# Altium schematic sheet Microcontroller.SchDoc
size A
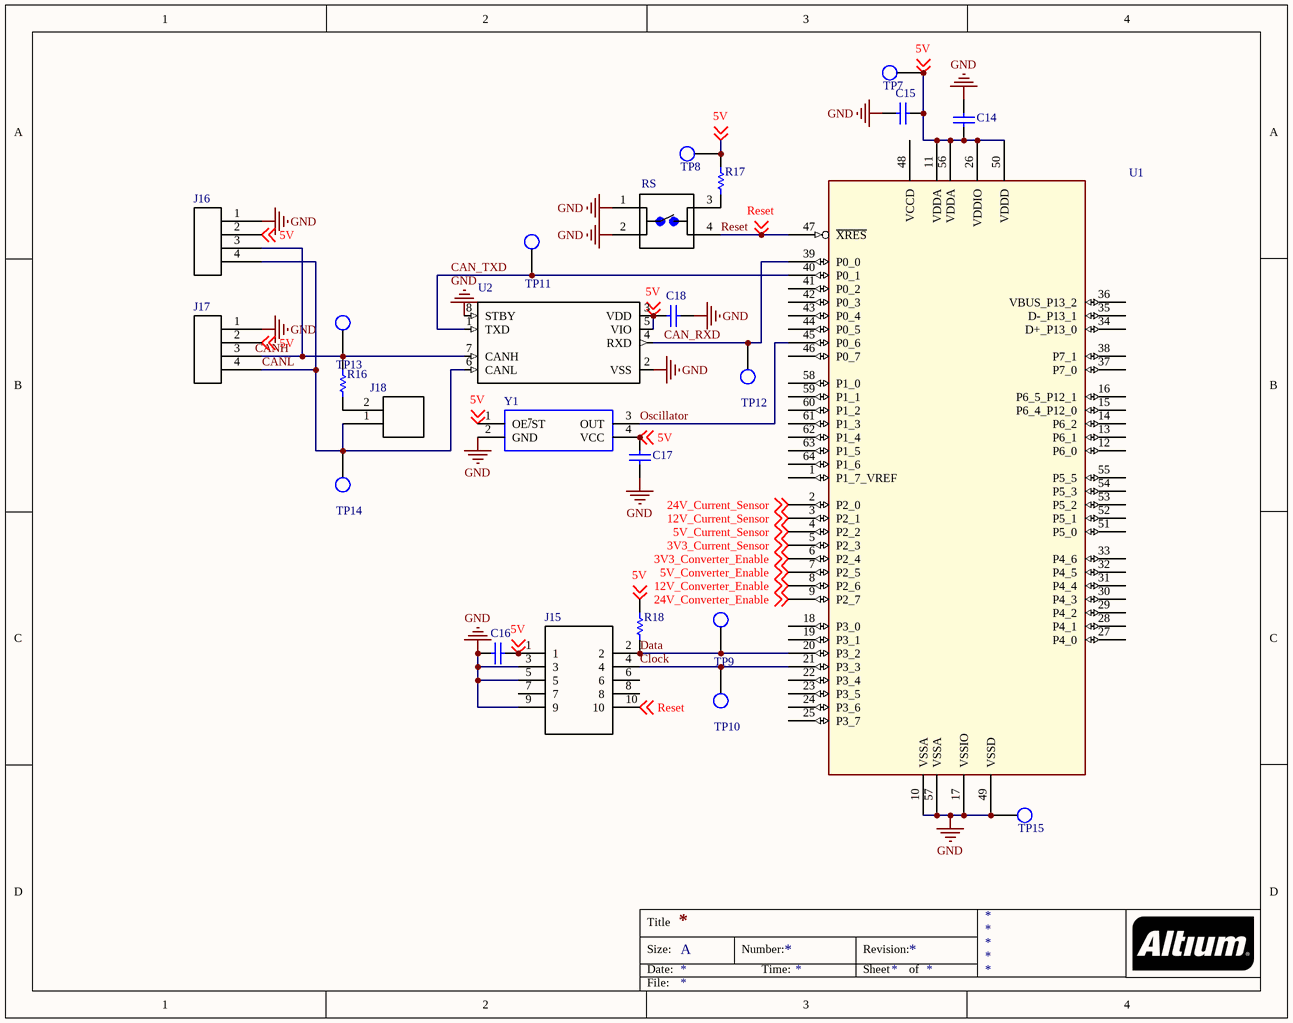
[diagram p0: Microcontroller.SchDoc]

## Parts
C14  10 μF  [Cap 0805]  (value not drawn)
C15  0.1 μF  [Cap 0805]  (value not drawn)
C16  0.1 μF  [Cap 0805]  (value not drawn)
C17  0.1 μF  [Cap 0805]  (value not drawn)
C18  0.1 μF  [Cap 0805]  (value not drawn)
J15  Programming Header  [programming]  (value not drawn)
J16  Molex Micro  [microfit 4 pin]  (value not drawn)
J17  Molex Micro  [microfit 4 pin]  (value not drawn)
J18  Molex micro-  [Microfit 2 pin]  (value not drawn)
R16  120R  [RESC0805(2012)_N]  (value not drawn)
R17  4.7 kOhm  [RESC0805(2012)_N]  (value not drawn)
R18  47 kOhm  [RESC0805(2012)_N]  (value not drawn)
RS  1825910-7  [Switch 6mm 24V (NO)]  (value not drawn)
TP7  Test Point  [Test Point Through-hole]  (value not drawn)
TP8  Test Point  [Test Point Through-hole]  (value not drawn)
TP9  Test Point  [Test Point Through-hole]  (value not drawn)
TP10  Test Point  [Test Point Through-hole]  (value not drawn)
TP11  Test Point  [Test Point Through-hole]  (value not drawn)
TP12  Test Point  [Test Point Through-hole]  (value not drawn)
TP13  Test Point  [Test Point Through-hole]  (value not drawn)
TP14  Test Point  [Test Point Through-hole]  (value not drawn)
TP15  Test Point  [Test Point Through-hole]  (value not drawn)
U1  CY8C4248AZI-L485  [TQFP50P1200X1200X160-64N]  (value not drawn)
U2  MCP2562-E/SN  [SOIC127P600X175-8N]  (value not drawn)
Y1  SG-636PCW_50.0000MC3__ROHS  [SG-636]  (value not drawn)

## Nets
GND: C14.2 C15.2 C16.2 C17.1 C18.1 J15.3 J15.5 J15.9 J16.1 J17.1 RS.1 RS.2 TP15.1 U1.10(VSSA) U1.17(VSSIO) U1.49(VSSD) U1.57(VSSA) U2.2(VSS) U2.8(STBY) Y1.2(GND)
3V3_Converter_Enable: U1.6(P2_4) ; off-sheet 3V3_Converter_Enable
3V3_Current_Sensor: U1.5(P2_3) ; off-sheet 3V3_Current_Sensor
5V: C14.1 C15.1 C16.1 C17.2 C18.2 J15.1 J16.2 J17.2 R17.2 R18.2 TP7.1 TP8.1 U1.11(VDDA) U1.26(VDDIO) U1.50(VDDD) U1.56(VDDA) U2.3(VDD) U2.5(VIO) Y1.1(OE~{/}ST) Y1.4(VCC) ; off-sheet 5V
5V_Converter_Enable: U1.7(P2_5) ; off-sheet 5V_Converter_Enable
5V_Current_Sensor: U1.4(P2_2) ; off-sheet 5V_Current_Sensor
12V_Converter_Enable: U1.8(P2_6) ; off-sheet 12V_Converter_Enable
12V_Current_Sensor: U1.3(P2_1) ; off-sheet 12V_Current_Sensor
24V_Converter_Enable: U1.9(P2_7) ; off-sheet 24V_Converter_Enable
24V_Current_Sensor: U1.2(P2_0) ; off-sheet 24V_Current_Sensor
CAN_RXD: TP12.1 U1.39(P0_0) U2.4(RXD)
CAN_TXD: TP11.1 U1.40(P0_1) U2.1(TXD)
CANL: J16.4 J17.4 J18.1 TP14.1 U2.6(CANL)
Clock: J15.4 TP10.1 U1.21(P3_3)
Data: J15.2 R18.1 TP9.1 U1.20(P3_2)
Oscillator: U1.45(P0_6) Y1.3(OUT)
Reset: J15.10 RS.4 U1.47(~{XRES}) ; off-sheet Reset
NetJ16_3: J16.3 J17.3 R16.2 TP13.1 U2.7(CANH)
NetJ18_2: J18.2 R16.1
NetR17_1: R17.1 RS.3

Not connected (* = marked no-connect by the designer): J15 6 7 8; U1 1(P1_7_VREF) 12(P6_0) 13(P6_1) 14(P6_2) 15(P6_4_P12_0) 16(P6_5_P12_1) 18(P3_0) 19(P3_1) 22(P3_4) 23(P3_5) 24(P3_6) 25(P3_7) 27(P4_0) 28(P4_1) 29(P4_2) 30(P4_3) 31(P4_4) 32(P4_5) 33(P4_6) 34(D+_P13_0) 35(D-_P13_1) 36(VBUS_P13_2) 37(P7_0) 38(P7_1) 41(P0_2) 42(P0_3) 43(P0_4) 44(P0_5) 46(P0_7) 48(VCCD) 51(P5_0) 52(P5_1) 53(P5_2) 54(P5_3) 55(P5_5) 58(P1_0) 59(P1_1) 60(P1_2) 61(P1_3) 62(P1_4) 63(P1_5) 64(P1_6)

## Notes on the sheet
- Labels drawn without touching a wire or pin: CANH
- Title
- Size:
- Date:
- A
- Number:
- Time:
- Revision:
- Sheet
- of
- File:

## Library data of the parts
C14-C18 = Capacitor 0805: Standard Capacitor; Mounting Technology: SurfaceMount; Case Size/Dimension: 0805; Package Reference: 0805
  C14: Capacitance: 10 μF
  C15-C18: Capacitance: 0.1 μF
J16 J17 = Molex micro-fit 4-pin (Single row schematic): Molex micro-fit 3.0 dual row header. P/N 0430450427
J18 = Molex micro-fit 2-pin: Molex micro-fit 3.0. Molex P/N 0430450227
R16 = Resistor 0805: Generic 0805 Resistor; Tolerance: 5 %; Case-Metric: 2012; Value: 120.00 Ohm; Case-EIA: 0805; Power: 0.125 W; Technology: SMT
R17 R18 = Resistor 0805: Generic 0805 Resistor; Case-EIA: 0805; Technology: SMT
  R17: Value: 4.7 kOhm
  R18: Value: 47 kOhm
RS = Switch 6mm 24V (NO): FSM4JAH=6MM TACT SWITCH, HIGH TEMP; MF: TE Connectivity; Contact_Current_Rating: 50 mA; Configuration_Pole-Throw: Single Pole - Single Throw; Package: None; Digi-Key_Part_Number: 450-1804-ND; Digi-Key_Purchase_URL: https://www.digikey.com/product-detail/en/te-connectivity-alcoswitch-switches/1825910-7/450-1804-ND/1731414?utm_source=snapeda&utm_medium=aggregator&utm_campaign=symbol; MP: 1825910-7; SnapEDA_Link: https://www.snapeda.com/parts/1825910-7/TE%20Connectivity%20ALCOSWITCH%20Switches/view-part/?ref=snap; EU_RoHS_Compliance: Compliant; TE_purchase_URL: https://www.te.com/usa-en/product-1825910-7.html?te_bu=Cor&te_type=disp&te_campaign=seda_glo_cor-seda-global-disp-prtnr-fy19-seda-model-bom-cta_sma-317_1&elqCampaignId=32493; Value: *
U1 = PSOC MC: 64 pin psoc; Part_Number: CY8C4248AZI-L485
U2 = CAN Tranceiver: Microchip MCP2562-E/SN, CAN Transceiver 1MBps 1-channel IEC 61000-4-2, 8-Pin SOIC; Price: None; MF: Microchip; SnapEDA_Link: https://www.snapeda.com/parts/MCP2562-E/SN/Microchip/view-part/?ref=snap; MP: MCP2562-E/SN; Availability: Unavailable; Package: SO-8 Microchip; Value: *
Y1 = Oscilator: Standard Clock Oscillators; Manufacturer_Name: Epson Timing; Manufacturer_Part_Number: SG-636PCW 50.0000MC3: ROHS; RS Part Number: *; RS Price/Stock: *; Arrow Part Number: SG-636PCW 50.0000MC3: ROHS; Arrow Price/Stock: *; Datasheet Link: http://www.mouser.com/ds/2/137/G-636PCE_en-1003252.pdf